# Altium schematic sheet BLDC_v3_p2.SCHDOC
size 594 x 420 mm; CompanyName: МГТУ СМ-7; SheetNumber: 2; SheetTotal: 2; Scale: 1:1; Title2str: Драйвер BLDC; DocumentType: Схема электрическая принципиальная
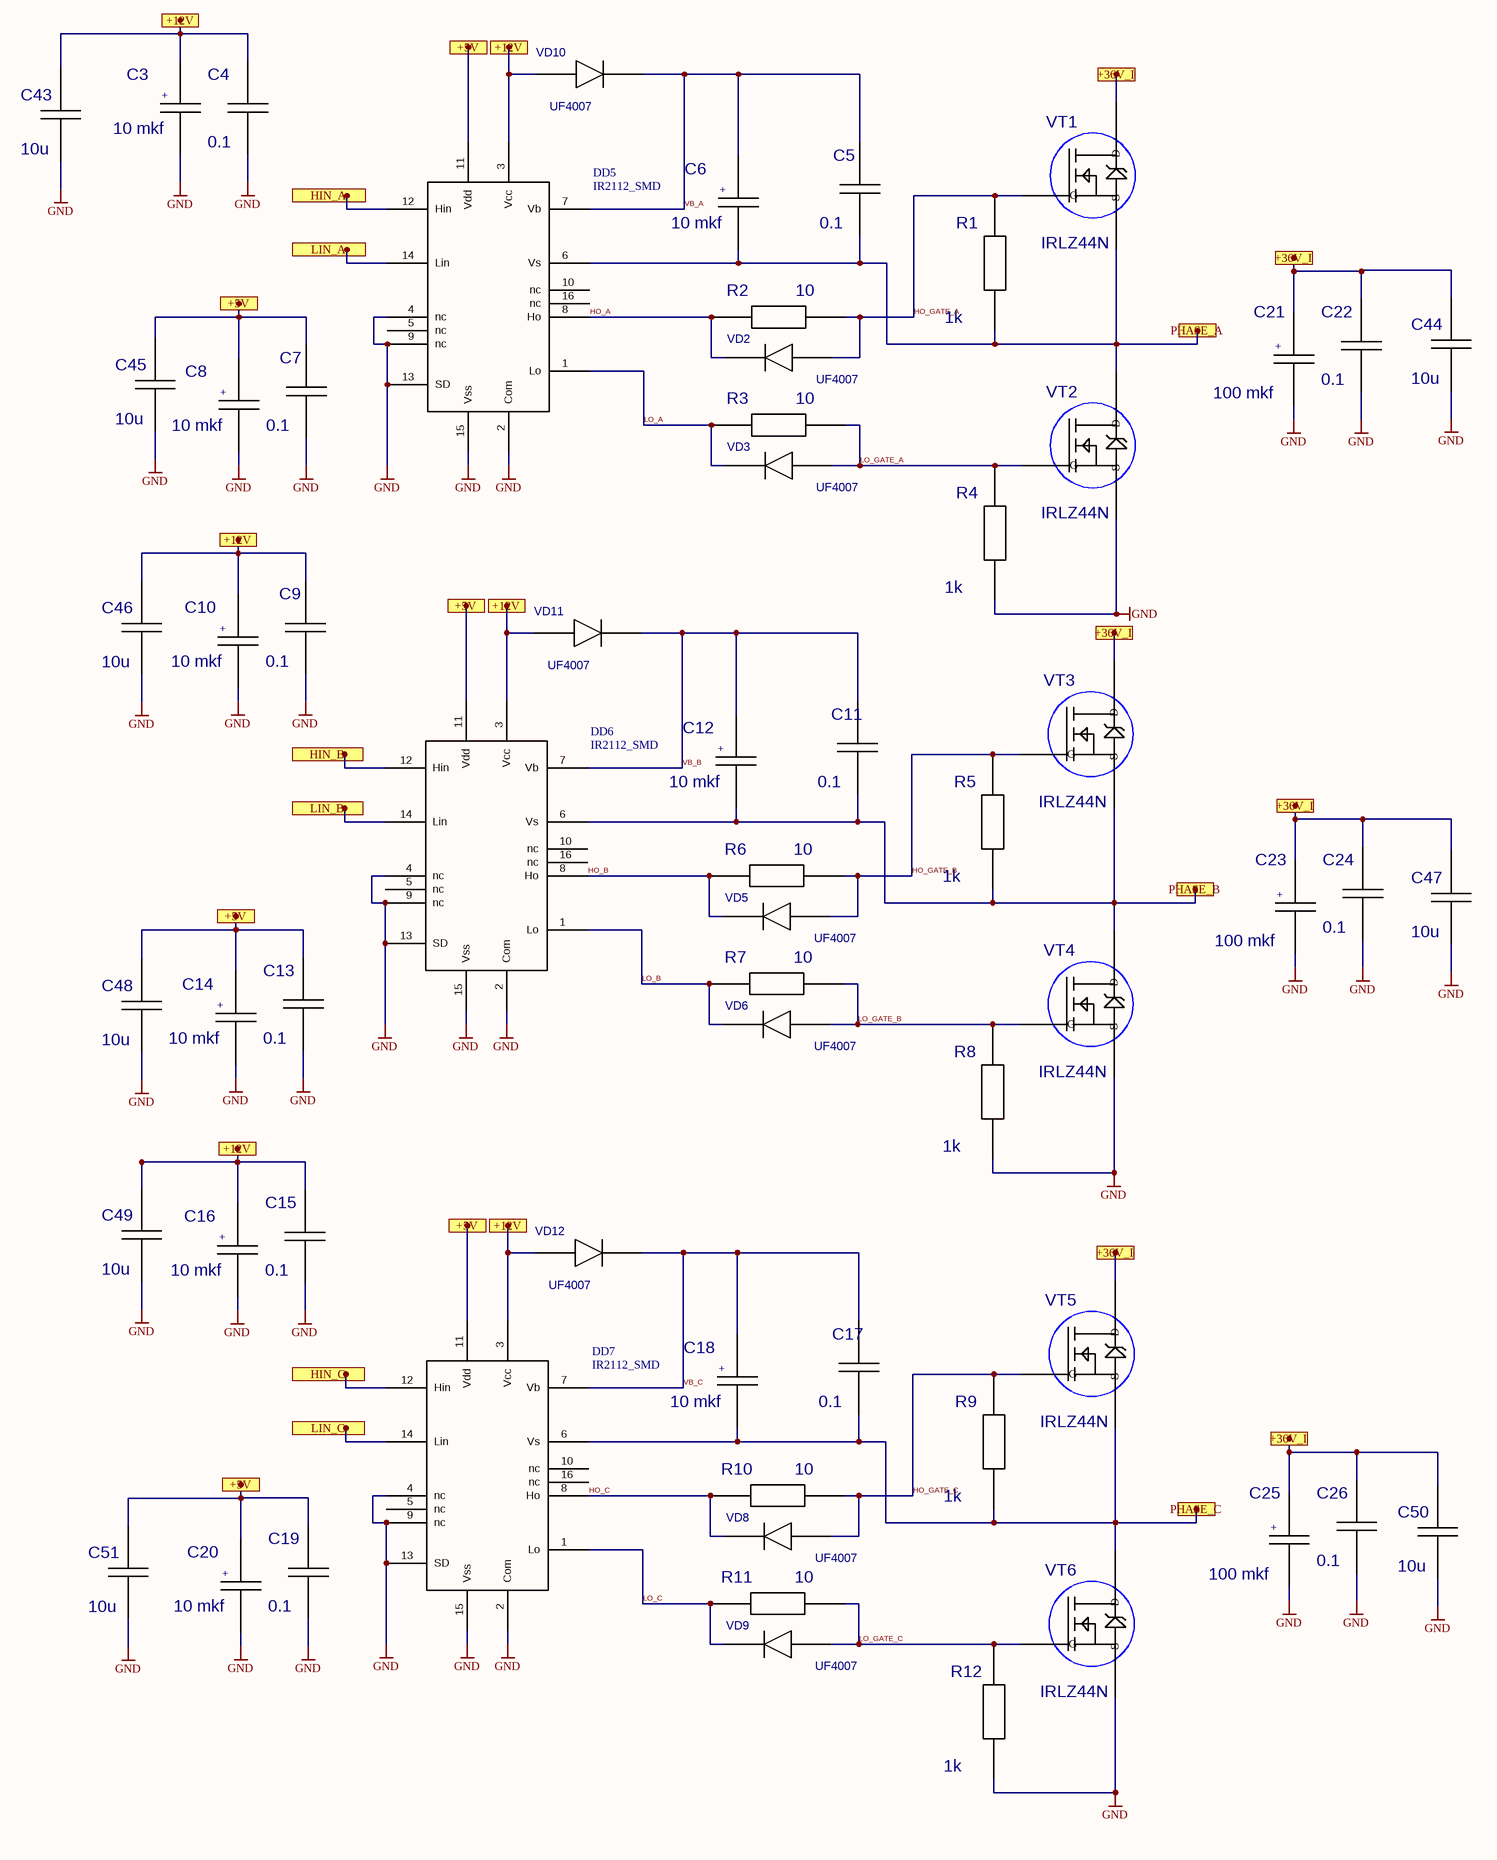
[diagram p0: BLDC_v3_p2.SCHDOC]

## Parts
C3  value 10 mkf  [C10_V]  (hidden comment: C10_V)
C4  value 0.1  [RC1206]  (hidden comment: C_1206)
C5  value 0.1  [RC1206]  (hidden comment: C_1206)
C6  value 10 mkf  [C10_V]  (hidden comment: C10_V)
C7  value 0.1  [RC1206]  (hidden comment: C_1206)
C8  value 10 mkf  [C10_V]  (hidden comment: C10_V)
C9  value 0.1  [RC1206]  (hidden comment: C_1206)
C10  value 10 mkf  [C10_V]  (hidden comment: C10_V)
C11  value 0.1  [RC1206]  (hidden comment: C_1206)
C12  value 10 mkf  [C10_V]  (hidden comment: C10_V)
C13  value 0.1  [RC1206]  (hidden comment: C_1206)
C14  value 10 mkf  [C10_V]  (hidden comment: C10_V)
C15  value 0.1  [RC1206]  (hidden comment: C_1206)
C16  value 10 mkf  [C10_V]  (hidden comment: C10_V)
C17  value 0.1  [RC1206]  (hidden comment: C_1206)
C18  value 10 mkf  [C10_V]  (hidden comment: C10_V)
C19  value 0.1  [RC1206]  (hidden comment: C_1206)
C20  value 10 mkf  [C10_V]  (hidden comment: C10_V)
C21  value 100 mkf  [C100_WIDE]  (hidden comment: C100_V_WIDE)
C22  value 0.1  [RC1206]  (hidden comment: C_1206)
C23  value 100 mkf  [C100_WIDE]  (hidden comment: C100_V_WIDE)
C24  value 0.1  [RC1206]  (hidden comment: C_1206)
C25  value 100 mkf  [C100_WIDE]  (hidden comment: C100_V_WIDE)
C26  value 0.1  [RC1206]  (hidden comment: C_1206)
C43  value 10u  [RC1206]  (hidden comment: C_1206)
C44  value 10u  [RC1206]  (hidden comment: C_1206)
C45  value 10u  [RC1206]  (hidden comment: C_1206)
C46  value 10u  [RC1206]  (hidden comment: C_1206)
C47  value 10u  [RC1206]  (hidden comment: C_1206)
C48  value 10u  [RC1206]  (hidden comment: C_1206)
C49  value 10u  [RC1206]  (hidden comment: C_1206)
C50  value 10u  [RC1206]  (hidden comment: C_1206)
C51  value 10u  [RC1206]  (hidden comment: C_1206)
DD5  IR2112_SMD  [SOIC16_N]
DD6  IR2112_SMD  [SOIC16_N]
DD7  IR2112_SMD  [SOIC16_N]
R1  value 1k  [CC1206]  (hidden comment: R_1206)
R2  value 10  [CC1206]  (hidden comment: R_1206)
R3  value 10  [CC1206]  (hidden comment: R_1206)
R4  value 1k  [CC1206]  (hidden comment: R_1206)
R5  value 1k  [CC1206]  (hidden comment: R_1206)
R6  value 10  [CC1206]  (hidden comment: R_1206)
R7  value 10  [CC1206]  (hidden comment: R_1206)
R8  value 1k  [CC1206]  (hidden comment: R_1206)
R9  value 1k  [CC1206]  (hidden comment: R_1206)
R10  value 10  [CC1206]  (hidden comment: R_1206)
R11  value 10  [CC1206]  (hidden comment: R_1206)
R12  value 1k  [CC1206]  (hidden comment: R_1206)
VD2  value UF4007  [DIODE_V_WIDE_HOLES]  (hidden comment: DIODE_LIE_WIDE)
VD3  value UF4007  [DIODE_V_WIDE_HOLES]  (hidden comment: DIODE_LIE_WIDE)
VD5  value UF4007  [DIODE_V_WIDE_HOLES]  (hidden comment: DIODE_LIE_WIDE)
VD6  value UF4007  [DIODE_V_WIDE_HOLES]  (hidden comment: DIODE_LIE_WIDE)
VD8  value UF4007  [DIODE_V_WIDE_HOLES]  (hidden comment: DIODE_LIE_WIDE)
VD9  value UF4007  [DIODE_V_WIDE_HOLES]  (hidden comment: DIODE_LIE_WIDE)
VD10  value UF4007  [DIODE_V_WIDE_HOLES]  (hidden comment: DIODE_LIE_WIDE)
VD11  value UF4007  [DIODE_V_WIDE_HOLES]  (hidden comment: DIODE_LIE_WIDE)
VD12  value UF4007  [DIODE_V_WIDE_HOLES]  (hidden comment: DIODE_LIE_WIDE)
VT1  IRLZ44N  [IRLZ44N]
VT2  IRLZ44N  [IRLZ44N]
VT3  IRLZ44N  [IRLZ44N]
VT4  IRLZ44N  [IRLZ44N]
VT5  IRLZ44N  [IRLZ44N]
VT6  IRLZ44N  [IRLZ44N]

## Ports
+5V, +12V, +36V_I, HIN_A, HIN_B, HIN_C, LIN_A, LIN_B, LIN_C, PHASE_A, PHASE_B, PHASE_C

## Nets
GND: C3.2(A1) C4.1(A1) C7.1(A1) C8.2(A1) C9.1(A1) C10.2(A1) C13.1(A1) C14.2(A1) C15.1(A1) C16.2(A1) C19.1(A1) C20.2(A1) C21.2(A1) C22.1(A1) C23.2(A1) C24.1(A1) C25.2(A1) C26.1(A1) C43.1(A1) C44.1(A1) C45.1(A1) C46.1(A1) C47.1(A1) C48.1(A1) C49.1(A1) C50.1(A1) C51.1(A1) DD5.2(Com) DD5.4(nc) DD5.9(nc) DD5.13(SD) DD5.15(Vss) DD6.2(Com) DD6.4(nc) DD6.9(nc) DD6.13(SD) DD6.15(Vss) DD7.2(Com) DD7.4(nc) DD7.9(nc) DD7.13(SD) DD7.15(Vss) R4.2(A2) R8.2(A2) R12.2(A2) VT2.3(S) VT4.3(S) VT6.3(S)
HO_A: DD5.8(Ho) R2.1(A1) VD2.2(A)
HO_B: DD6.8(Ho) R6.1(A1) VD5.2(A)
HO_C: DD7.8(Ho) R10.1(A1) VD8.2(A)
HO_GATE_A: R1.1(A1) R2.2(A2) VD2.1(C) VT1.1(G)
HO_GATE_B: R5.1(A1) R6.2(A2) VD5.1(C) VT3.1(G)
HO_GATE_C: R9.1(A1) R10.2(A2) VD8.1(C) VT5.1(G)
LO_A: DD5.1(Lo) R3.1(A1) VD3.2(A)
LO_B: DD6.1(Lo) R7.1(A1) VD6.2(A)
LO_C: DD7.1(Lo) R11.1(A1) VD9.2(A)
LO_GATE_A: R3.2(A2) R4.1(A1) VD3.1(C) VT2.1(G)
LO_GATE_B: R7.2(A2) R8.1(A1) VD6.1(C) VT4.1(G)
LO_GATE_C: R11.2(A2) R12.1(A1) VD9.1(C) VT6.1(G)
VB_A: C5.2(A2) C6.1(A2) DD5.7(Vb) VD10.2(A)
VB_B: C11.2(A2) C12.1(A2) DD6.7(Vb) VD11.2(A)
VB_C: C17.2(A2) C18.1(A2) DD7.7(Vb) VD12.2(A)
NetC3_1: C3.1(A2) C4.2(A2) C43.2(A2)
NetC5_1: C5.1(A1) C6.2(A1) DD5.6(Vs) R1.2(A2) VT1.3(S) VT2.2(D)
NetC7_2: C7.2(A2) C8.1(A2) C45.2(A2)
NetC9_2: C9.2(A2) C10.1(A2) C46.2(A2)
NetC11_1: C11.1(A1) C12.2(A1) DD6.6(Vs) R5.2(A2) VT3.3(S) VT4.2(D)
NetC13_2: C13.2(A2) C14.1(A2) C48.2(A2)
NetC15_2: C15.2(A2) C16.1(A2) C49.2(A2)
NetC17_1: C17.1(A1) C18.2(A1) DD7.6(Vs) R9.2(A2) VT5.3(S) VT6.2(D)
NetC19_2: C19.2(A2) C20.1(A2) C51.2(A2)
NetC21_1: C21.1(A2) C22.2(A2) C44.2(A2)
NetC23_1: C23.1(A2) C24.2(A2) C47.2(A2)
NetC25_1: C25.1(A2) C26.2(A2) C50.2(A2)
NetDD5_3: DD5.3(Vcc) VD10.1(C)
NetDD6_3: DD6.3(Vcc) VD11.1(C)
NetDD7_3: DD7.3(Vcc) VD12.1(C)

Not connected (* = marked no-connect by the designer): DD5 5(nc) 10(nc) 11(Vdd) 12(Hin) 14(Lin) 16(nc); DD6 5(nc) 10(nc) 11(Vdd) 12(Hin) 14(Lin) 16(nc); DD7 5(nc) 10(nc) 11(Vdd) 12(Hin) 14(Lin) 16(nc); VT1 2(D); VT3 2(D); VT5 2(D)

## Notes on the sheet
- Перв. примен.
- Справ. №
- Подп. и дата
- Инв. № дубл.
- Взам. инв. №
- Разраб.
- Изм.
- Лист
- № докум.
- Подп.
- Дата
- Лит.
- Масса
- Масштаб
- Пров.
- Т.контр.
- Листов
- Инв. № подл.
- Утв.
- Н.контр.
- 2.106-A2
- Копировал
- Формат А2
- (in symbol C10_V) +
- (in symbol C100_V_WIDE) +

## Library data of the parts
DD5-DD7 = IR2112_SMD: High and Low Side Driver; Note: Pins 4, 5, 9, 10 and 16 are not connected; Published: 8-Jun-2000; LatestRevisionDate: 13-Apr-2006; LatestRevisionNote: IPC-7351 Footprint Added.; DatasheetVersion: PD60026J; PackageReference: SOIC16; Publisher: Altium Limited; PackageDescription: 16-Pin Small Outline Integrated Circuit 1.27 mm Pitch; Code_JEDEC: MS-013-AA; Code_IPC: SOIC127P1030-16; ComponentLink1Description: Manufacturer Link; ComponentLink1URL: http://www.irf.com/; ComponentLink2Description: Datasheet; ComponentLink2URL: http://www.irf.com/product-info/datasheets/data/ir2112.pdf
VT1-VT6 = IRLZ44N: Value: *